# EAGLE schematic H-Bridge Schematic (EAGLE 9.6.2)
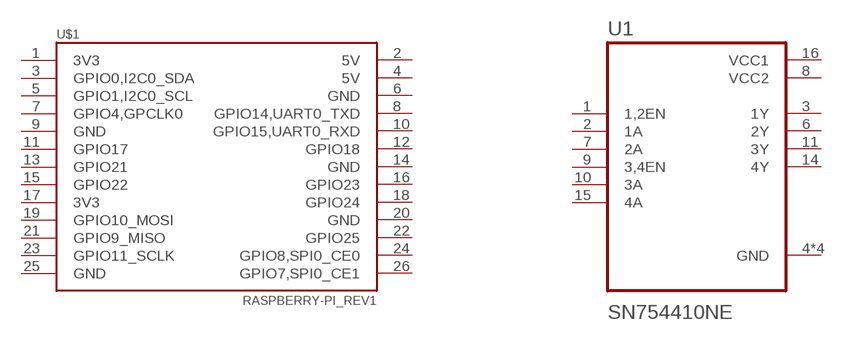
[diagram p0: schematic, sheet 1]

## Parts
U1  SN754410NE  [DIP762W45P254L1980H508Q16]
U$1  RASPBERRY-PI_REV1  [RASPBERRY-PI_REV1]
Unconnected: U1.1(1,2EN) U1.2(1A) U1.3(1Y) U1.6(2Y) U1.7(2A) U1.9(3,4EN) U1.10(3A) U1.11(3Y) U1.14(4Y) U1.15(4A) U$1.1(3V3) U$1.2(5V) U$1.3(GPIO0,I2C0_SDA) U$1.4(5V) U$1.5(GPIO1,I2C0_SCL) U$1.6(GND) U$1.7(GPIO4,GPCLK0) U$1.8(GPIO14,UART0_TXD) U$1.9(GND) U$1.10(GPIO15,UART0_RXD) U$1.11(GPIO17) U$1.12(GPIO18) U$1.13(GPIO21) U$1.14(GND) U$1.15(GPIO22) U$1.16(GPIO23) U$1.17(3V3) U$1.18(GPIO24) U$1.19(GPIO10_MOSI) U$1.20(GND) U$1.21(GPIO9_MISO) U$1.22(GPIO25) U$1.23(GPIO11_SCLK) U$1.24(GPIO8,SPI0_CE0) U$1.25(GND) U$1.26(GPIO7,SPI0_CE1)

## Power pins joined to a net without a drawn wire
GND: U1.4(GND) U1.5(GND) U1.12(GND) U1.13(GND)
VCC1: U1.16(VCC1)
VCC2: U1.8(VCC2)

## Library data of the parts
U1 = SN754410NE:SN754410NE: Check availability <https://pricing.snapeda.com/parts/SN754410NE/Texas%20Instruments/view-part?ref=eda>; AVAILABILITY: In Stock; DESCRIPTION: Quadruple Half-H Drivers 16-PDIP -40 to 85; MF: Texas Instruments; MP: SN754410NE; PACKAGE: PDIP-16 Texas Instruments; PRICE: None; PURCHASE-URL: https://pricing.snapeda.com/search/part/SN754410NE/?ref=eda
U$1 = RaspberryPi:RASPBERRY-PI_REV1: Raspberry Pi Board <http://www.raspberrypi.org/> Jacques Lagnel V1.0 (beta) 2012 Mateusz Bawaj V1.1 (beta) 2012 Board dimension: Forum 3D model <http://www.raspberrypi.org/forum/general-discussion/mechanical-profile-3d-models?value=3d%20model&type=1&include=1&search=1&ret=all> The GPIO Connector (P1): http://elinux.org/RPi_Low-level_peripherals